# EAGLE design dcdc3to5 (EAGLE 5.06)
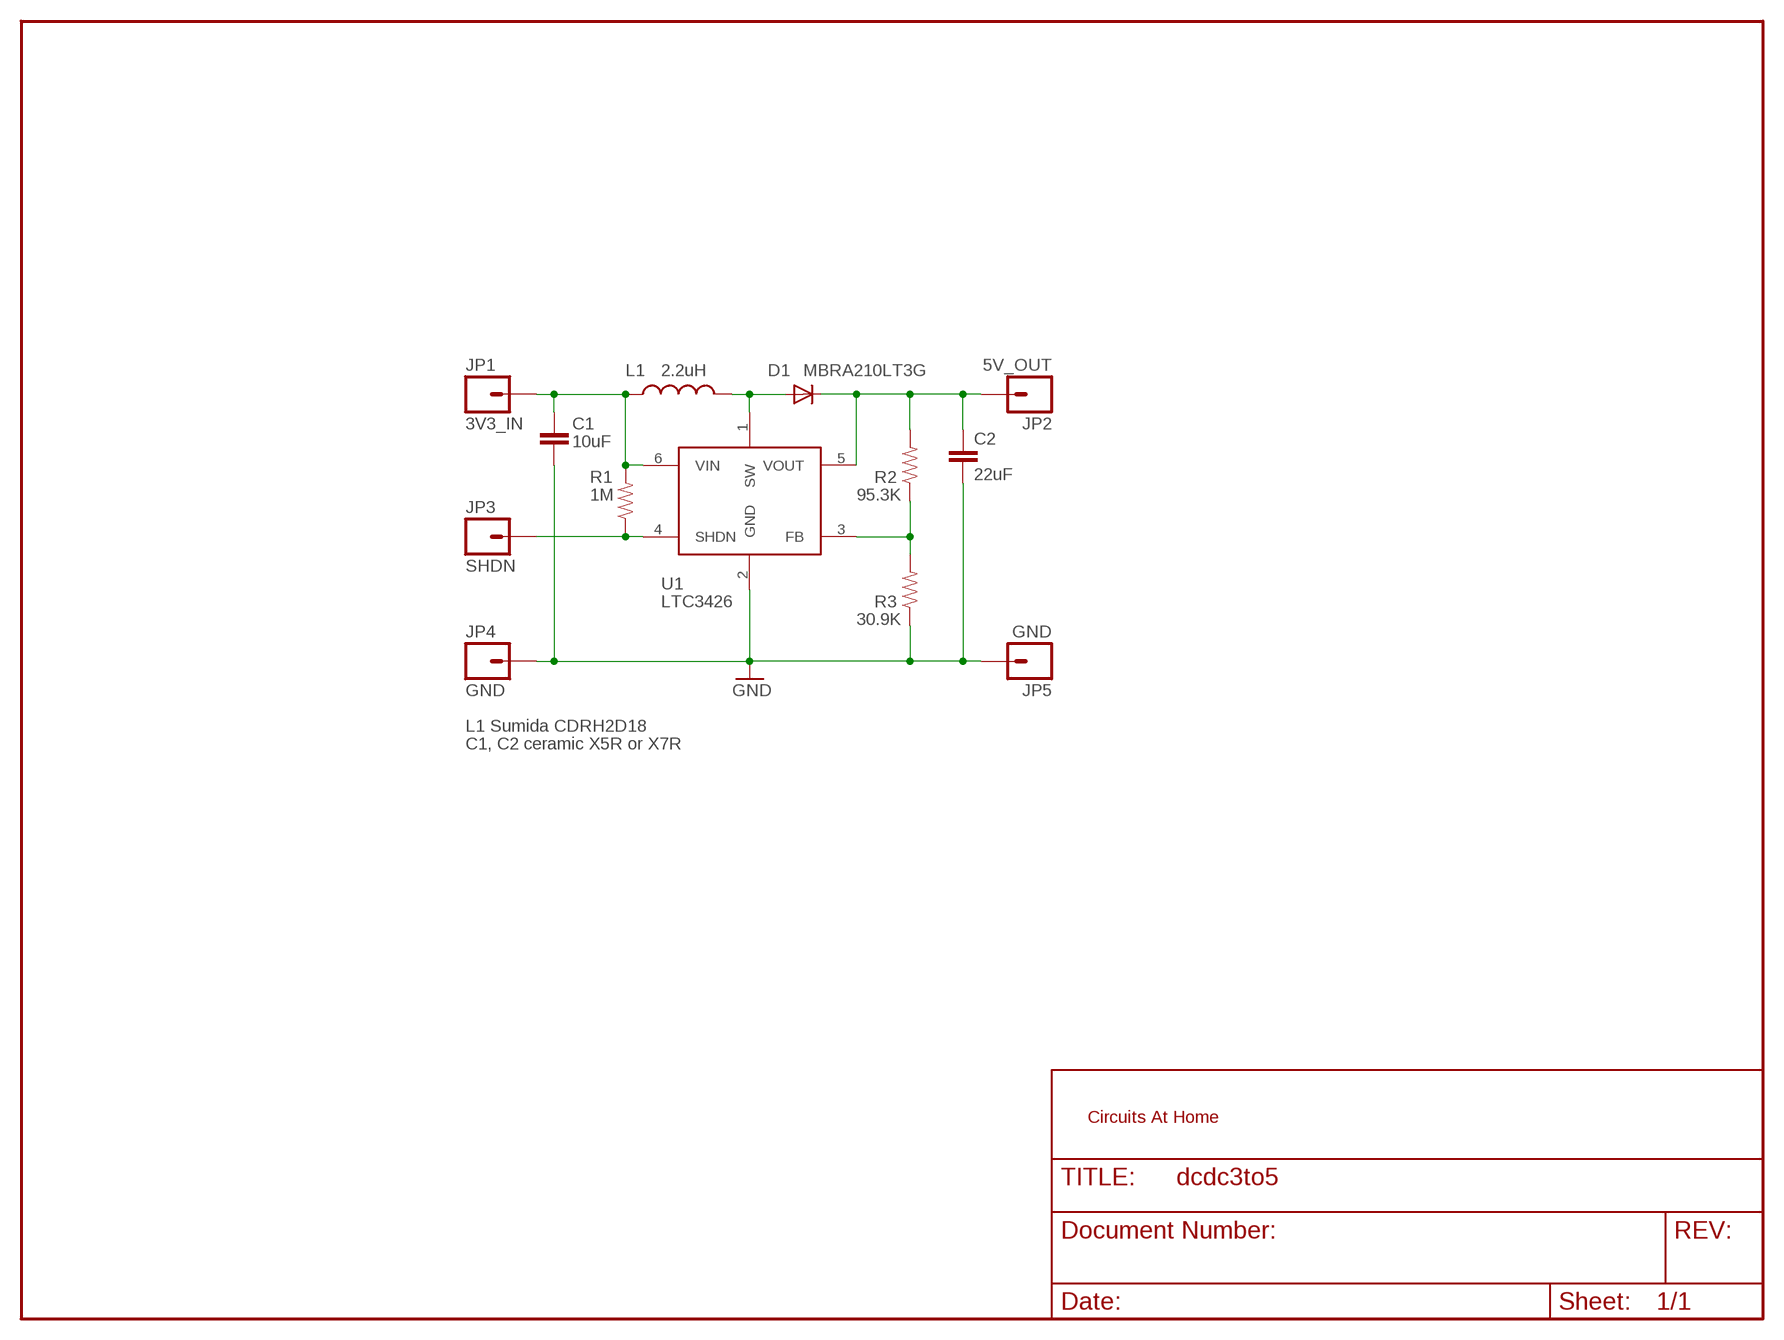
[diagram p0: schematic, sheet 1]

## Parts
C1  10uF  CAP0603  [0603]
C2  22uF  CAP1206  [1206]
D1  MBRA210LT3G  DIODESMA  [SMA-DIODE]
JP1  3V3_IN  M01PTH  [1X01]
JP2  5V_OUT  M01PTH  [1X01]
JP3  SHDN  M01PTH  [1X01]
JP4  GND  M01PTH  [1X01]
JP5  GND  M01PTH  [1X01]
L1  2.2uH  INDUCTOR1313  [1_3X1_3]
R1  1M  RESISTOR0603  [0603]
R2  95.3K  RESISTOR0603  [0603]
R3  30.9K  RESISTOR0603  [0603]
U1  LTC3426  [SOT23-6]

## Nets
3V3_IN: C1.1 JP1.1 L1.P$1 R1.2 U1.6(VIN)
GND: C1.2 C2.2 JP4.1 JP5.1 R3.1 U1.2(GND)
N$22: D1.A L1.P$2 U1.1(SW)
N$23: JP3.1 R1.1 U1.4(SHDN)
N$28: R2.1 R3.2 U1.3(FB)
N$31: C2.1 D1.C JP2.1 R2.2 U1.5(VOUT)

## Notes on the sheet
- L1 Sumida CDRH2D18
- C1, C2 ceramic X5R or X7R

## Library data of the parts
C1 C2 = CH_passive:CAP: Capacitor Standard 0603 ceramic capacitor, and 0.1" leaded capacitor.
D1 = CH_semiconductors:DIODE: Diode These are standard reverse protection diodes and small signal diodes. SMA package can handle up to about 1A. SOD-323 can handle about 200mA. What the SOD-323 package when ordering, there are some mfgs out there that are 5-pin packages.
JP1-JP5 = CH_connectors:M01: Header 1 Standard 1-pin 0.1" header. Use with straight break away headers (SKU : PRT-00116), right angle break away headers (PRT-00553), swiss pins (PRT-00743), machine pins (PRT-00117), and female headers (PRT-00115).
L1 = CH_passive:INDUCTOR: Inductors Basic Inductor/Choke - 0603 and 1206. Footprints are not proven and vary greatly between part numbers.
R1-R3 = CH_passive:RESISTOR: Resistor Basic schematic elements and footprints for 0603, 1206, and PTH 1/10th watt (small) resistors.
U1 = CH_Linear_technology:LTC3426

## Board
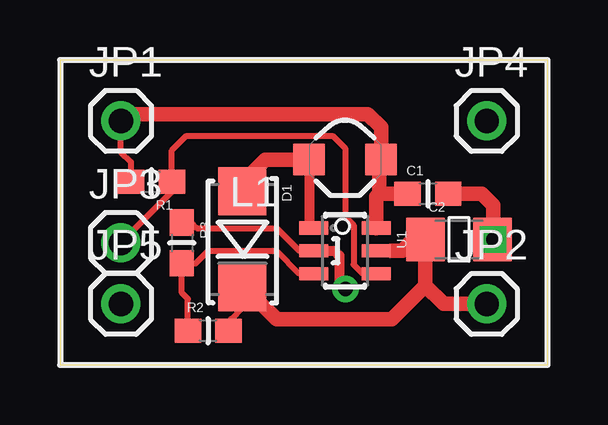
[diagram p1: board, top side]
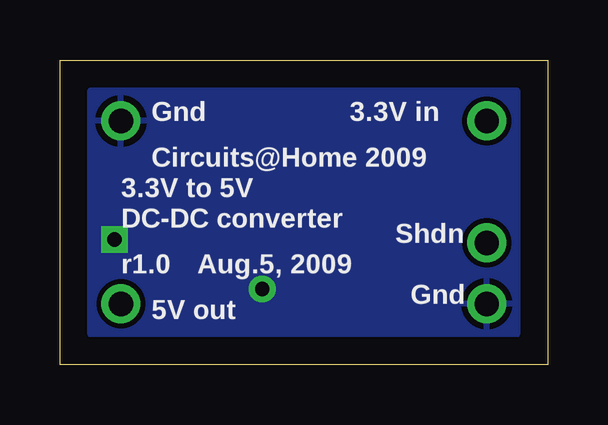
[diagram p2: board, bottom side, seen from below]

Size 20.32 x 12.7 mm. Coordinates in mm from the lower left corner, seen from the top.
Outline: 0,0 20.32,0 20.32,12.7 0,12.7 0,0
Copper layers (1*16): Top 0.035mm / dielectric 1.5mm / Bottom 0.035mm
Design rules "CHome": minimum track width 8mil, minimum drill 20mil, track to track 8mil, track to pad 8mil, pad to pad 8mil, via to via 8mil, smd to smd 8mil, copper to edge 10mil, drill to drill 8mil, minimum pad ring 12mil, minimum via ring 10mil, stop-mask expansion 4mil, vias tented up to drill 25mil, thermal gap 10mil

### Footprints (pad centres in the part's own frame; a part is rotated, then mirrored left to right if it is on the bottom)
0603 = smd 1.1 x 1: 1 -0.85,0; 2 0.85,0
1206 = smd 1.6 x 1.8: 1 -1.4,0; 2 1.4,0
SMA-DIODE = smd 2 x 2: A -2,0; C 2,0
1X01 = drill 1.016 round: 1 0,0
1_3X1_3 = smd 1.3 x 1.3: P$1 -1.5,0; P$2 1.5,0
SOT23-6 = smd 0.55 x 1.2: 1 -0.95,-1.3; 2 0,-1.3; 3 0.95,-1.3; 4 0.95,1.3; 5 0,1.3; 6 -0.95,1.3

### Placement (x,y rotation side)
C1  15.33,7.12 0 top
C2  16.62,5.22 0 top
D1  7.6,5.22 270 top
JP1  2.54,10.16 0 top
JP2  17.78,2.54 0 top
JP3  2.54,5.08 0 top
JP4  17.78,10.16 0 top
JP5  2.54,2.54 0 top
L1  11.88,8.55 180 top
R1  3.81,7.62 180 top
R2  6.17,1.43 0 top
R3  5.08,5.08 270 top
U1  11.88,4.75 270 top

### Tracks (layer width: path | path; a pad name or v marks a point on that pad's centre or on a via)
3V3_IN
  Top 0.254: JP1.1 2.54,8.86 2.96,8.44 R1.2
  Top 0.61: JP1.1 2.83,10.45 12.82,10.45 13.38,9.9 L1.P$1 13.3,8.47 13.3,7.12 | U1.6 13.18,7 13.3,7.12 | 13.3,7.12 C1.1
GND  (via drill 0.6)
  Top 0.254: U1.2 9.97,4.75 9.03,5.7 5.7,5.7 5.47,5.93 R3.1
  Top 0.406: U1.2 11.44,4.75 11.64,4.55 11.64,3.41 v11.89,3.16
  Top 0.61: C2.2 v18.05,5.22 C2.2 | C1.2 17.57,7.12 18.05,6.65 18.05,5.25 C2.2
  pour Bottom: 1.27,11.43 1.27,1.27 19.05,1.27 19.05,11.43
N$22
  Top 0.254: D1.A 8.07,8.07
  Top 0.406: L1.P$2 10.38,5.9 U1.1
  Top 0.61: L1.P$2 8.55,8.55 8.07,8.07
N$23
  Top 0.254: U1.4 12.61,3.8 12.24,4.17 12.24,5.82 11.88,6.17 11.88,9.03 11.36,9.54 5.26,9.54 4.66,8.94 R1.1 4.66,7.2 JP3.1
N$28
  Top 0.254: U1.3 9.97,3.8 9.03,4.75 6.17,4.75 5.66,4.23 R3.2 5.08,3 5.33,2.75 R2.1
N$31
  Top 0.254: 7.97,3.33 D1.C 7.6,2.38 7.12,1.9 7.12,1.52 R2.2
  Top 0.406: 13.78,4.75 U1.5
  Top 0.61: 13.78,4.75 14.25,4.75 14.72,5.22 C2.1 15.22,3.3 | JP2.1 15.98,2.54 15.22,3.3 | 7.97,3.33 7.97,2.95 9.03,1.9 13.82,1.9 15.22,3.3

### Text on the board
_tsilk: C@Home | Aug.5,09 | Vin | Gnd | 1M | 10u | Sh | 22u | Gn | Vout | 95.3K | r1.0
_bsilk: 3.3V in | Gnd | Circuits@Home 2009 | 3.3V to 5V | DC-DC converter | Shdn | Aug.5, 2009 | r1.0 | Gnd | 5V out